# EAGLE design nfc-pn532 (EAGLE 9.6.2)
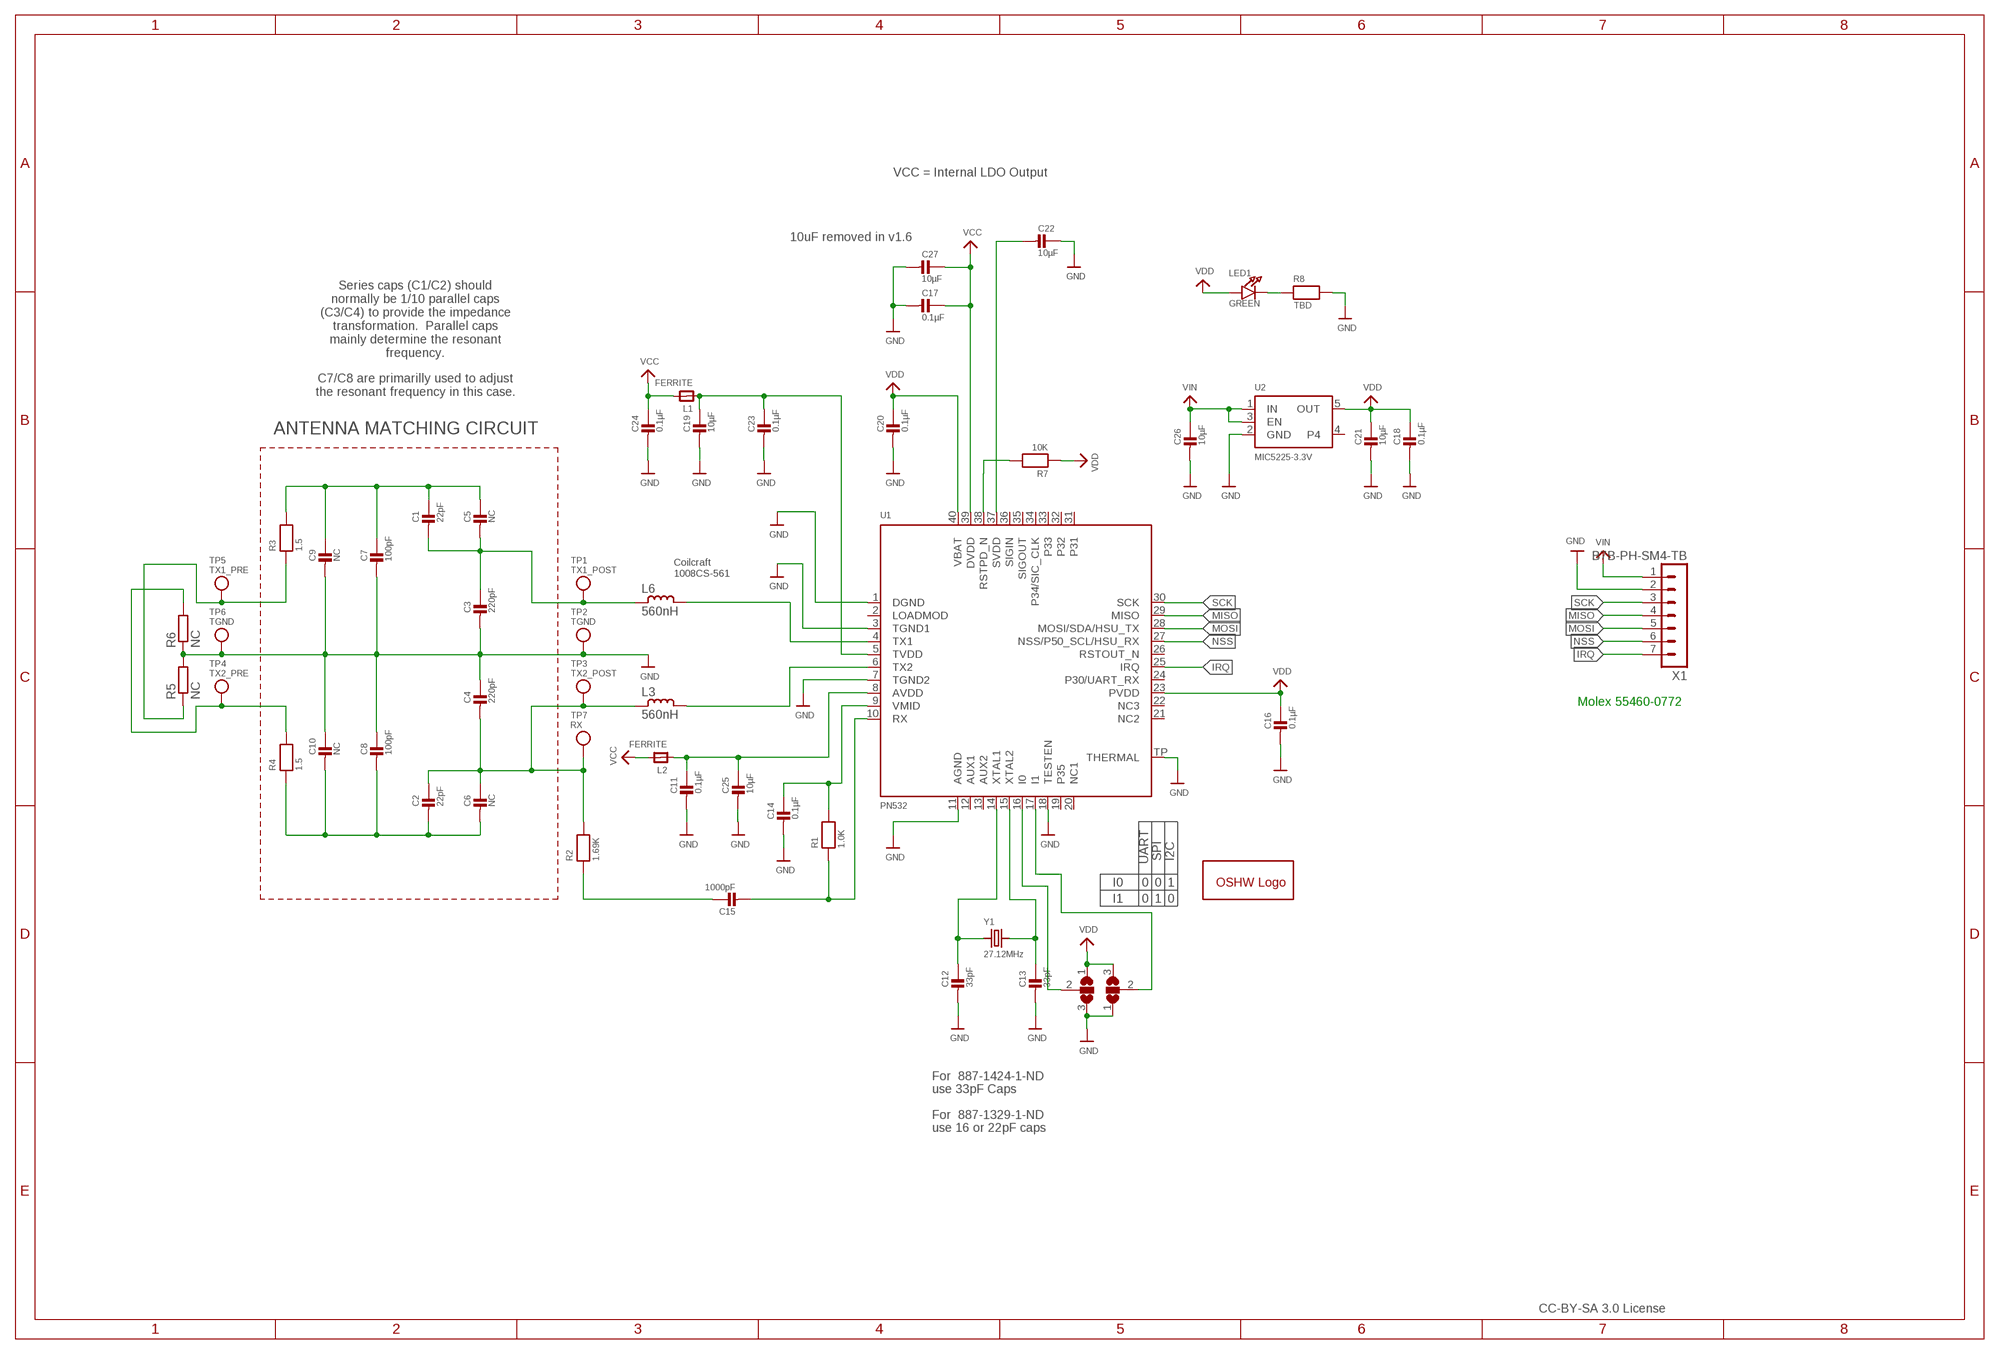
[diagram p0: schematic, sheet 1]

## Parts
C1  22pF  CAP_CERAMIC0805-NOOUTLINE  [0805-NO]
C2  22pF  CAP_CERAMIC0805-NOOUTLINE  [0805-NO]
C3  220pF  CAP_CERAMIC0805-NOOUTLINE  [0805-NO]
C4  220pF  CAP_CERAMIC0805-NOOUTLINE  [0805-NO]
C5  NC  CAP_CERAMIC0805-NOOUTLINE  [0805-NO]
C6  NC  CAP_CERAMIC0805-NOOUTLINE  [0805-NO]
C7  100pF  CAP_CERAMIC0805-NOOUTLINE  [0805-NO]
C8  100pF  CAP_CERAMIC0805-NOOUTLINE  [0805-NO]
C9  NC  CAP_CERAMIC0805-NOOUTLINE  [0805-NO]
C10  NC  CAP_CERAMIC0805-NOOUTLINE  [0805-NO]
C11  0.1µF  CAP_CERAMIC0805-NOOUTLINE  [0805-NO]
C12  33pF  CAP_CERAMIC0805-NOOUTLINE  [0805-NO]
C13  33pF  CAP_CERAMIC0805-NOOUTLINE  [0805-NO]
C14  0.1µF  CAP_CERAMIC0805-NOOUTLINE  [0805-NO]
C15  1000pF  CAP_CERAMIC0805-NOOUTLINE  [0805-NO]
C16  0.1µF  CAP_CERAMIC0805-NOOUTLINE  [0805-NO]
C17  0.1µF  CAP_CERAMIC0805-NOOUTLINE  [0805-NO]
C18  0.1µF  CAP_CERAMIC0805-NOOUTLINE  [0805-NO]
C19  10µF  CAP_CERAMIC0805-NOOUTLINE  [0805-NO]
C20  0.1µF  CAP_CERAMIC0805-NOOUTLINE  [0805-NO]
C21  10µF  CAP_CERAMIC0805-NOOUTLINE  [0805-NO]
C22  10µF  CAP_CERAMIC0805-NOOUTLINE  [0805-NO]
C23  0.1µF  CAP_CERAMIC0805-NOOUTLINE  [0805-NO]
C24  0.1µF  CAP_CERAMIC0805-NOOUTLINE  [0805-NO]
C25  10µF  CAP_CERAMIC0805-NOOUTLINE  [0805-NO]
C26  10µF  CAP_CERAMIC0805-NOOUTLINE  [0805-NO]
C27  10µF  CAP_CERAMIC0805-NOOUTLINE  [0805-NO]
GOLD_ORB_SM1  OSHWLOGOLOGO5MM  [OSHW_5MM]
L1  FERRITE  FERRITE0805  [0805]
L2  FERRITE  FERRITE0805  [0805]
L3  560nH  L-1008CS  [L1008CS]
L6  560nH  L-1008CS  [L1008CS]
LED1  GREEN  LED0805_NOOUTLINE  [CHIPLED_0805_NOOUTLINE]
R1  1.0K  RESISTOR0805_NOOUTLINE  [0805-NO]
R2  1.69K  RESISTOR0805_NOOUTLINE  [0805-NO]
R3  1.5  RESISTOR0805_NOOUTLINE  [0805-NO]
R4  1.5  RESISTOR0805_NOOUTLINE  [0805-NO]
R5  NC  R-EU_R0201  [R0201]
R6  NC  R-EU_R0201  [R0201]
R7  10K  RESISTOR0805_NOOUTLINE  [0805-NO]
R8  TBD  RESISTOR0805_NOOUTLINE  [0805-NO]
SJ1  SJ2W  [SJ_2]
SJ2  SJ2W  [SJ_2]
TP1  TX1_POST  TESTPOINTROUND1MM  [TESTPOINT_ROUND_1MM]
TP2  TGND  TESTPOINTROUND1MM  [TESTPOINT_ROUND_1MM]
TP3  TX2_POST  TESTPOINTROUND1MM  [TESTPOINT_ROUND_1MM]
TP4  TX2_PRE  TESTPOINTROUND1MM  [TESTPOINT_ROUND_1MM]
TP5  TX1_PRE  TESTPOINTROUND1MM  [TESTPOINT_ROUND_1MM]
TP6  TGND  TESTPOINTROUND1MM  [TESTPOINT_ROUND_1MM]
TP7  RX  TESTPOINTROUND1MM  [TESTPOINT_ROUND_1MM]
U1  PN532  [HVQFN40-6X6]
U2  MIC5225-3.3V  VREG_SOT23-5  [SOT23-5]
X1  B7B-PH-SM4-TB  [B7B-PH-SM4-TB]
Y1  27.12MHz  CRYSTAL3.2X2.5  [CRYSTAL_3.2X2.5]

## Nets
+5.0V: C26.1 U2.1(IN) U2.3(EN) X1.1 ; supply symbol labelled VIN
GND: C3.2 C4.1 C7.2 C8.1 C9.2 C10.1 C11.2 C12.2 C13.2 C14.2 C16.2 C17.2 C18.2 C19.2 C20.2 C21.2 C22.1 C23.2 C24.2 C25.2 C26.2 C27.2 R5.2 R6.1 R8.2 SJ1.3 SJ2.1 TP2.P$1 TP6.P$1 U1.1(DGND) U1.3(TGND1) U1.7(TGND2) U1.11(AGND) U1.18(TESTEN) U1.TP(THERMAL) U2.2(GND) X1.2
IRQ: U1.25(IRQ) X1.7
MISO: U1.29(MISO) X1.4
MOSI: U1.28(MOSI/SDA/HSU_TX) X1.5
N$1: L6.2 U1.4(TX1)
N$2: L3.2 U1.6(TX2)
N$3: C1.2 C3.1 C5.2 L6.1 TP1.P$1
N$4: SJ1.2 U1.16(I0)
N$5: SJ2.2 U1.17(I1)
N$6: LED1.C R8.1
N$7: C12.1 U1.14(XTAL1) Y1.1
N$8: C13.1 U1.15(XTAL2) Y1.2
N$9: C15.1 R2.1
N$10: C14.1 R1.2 U1.9(VMID)
N$11: C15.2 R1.1 U1.10(RX)
N$12: C2.1 C4.2 C6.1 L3.1 R2.2 TP3.P$1 TP7.P$1
N$13: C11.1 C25.1 L2.1 U1.8(AVDD)
N$14: C19.1 C23.1 L1.1 U1.5(TVDD)
N$15: C22.2 U1.37(SVDD)
N$16: R3.1 R5.1 TP5.P$1
N$17: R4.2 R6.2 TP4.P$1
NSS: U1.27(NSS/P50_SCL/HSU_RX) X1.6
RSTPD_N: R7.2 U1.38(RSTPD_N)
SCK: U1.30(SCK) X1.3
TX1_ANTENNA: C1.1 C5.1 C7.1 C9.1 R3.2
TX2_ANTENNA: C2.2 C6.2 C8.2 C10.2 R4.1
VCC: C17.1 C24.1 C27.1 L1.2 L2.2 U1.39(DVDD)
VDD: C16.1 C18.1 C20.1 C21.1 LED1.A R7.1 SJ1.1 SJ2.3 U1.23(PVDD) U1.40(VBAT) U2.5(OUT)
Unconnected: U1.2(LOADMOD) U1.12(AUX1) U1.13(AUX2) U1.19(P35) U1.20(NC1) U1.21(NC2) U1.22(NC3) U1.24(P30/UART_RX) U1.26(RSTOUT_N) U1.31 U1.32 U1.33 U1.34(P34/SIC_CLK) U1.35(SIGOUT) U1.36(SIGIN) U2.4

## Notes on the sheet
- VCC = Internal LDO Output
- 10uF removed in v1.6
- Series caps (C1/C2) should
  normally be 1/10 parallel caps
  (C3/C4) to provide the impedance
  transformation.  Parallel caps
  mainly determine the resonant
  frequency.
- C7/C8 are primarilly used to adjust
  the resonant frequency in this case.
- ANTENNA MATCHING CIRCUIT
- Coilcraft 
  1008CS-561
- Molex 55460-0772
- UART | SPI | I2C
- I0 | 0 | 0 | 1
- I1 | 0 | 1 | 0
- For  887-1424-1-ND
- use 33pF Caps
- For  887-1329-1-ND
- use 16 or 22pF caps
- CC-BY-SA 3.0 License

## Library data of the parts
C1-C27 = microbuilder:CAP_CERAMIC: Ceramic Capacitors For new designs, use the packages preceded by an '_' character since they are more reliable: The following footprints should be used on most boards: _0402 - Standard footprint for regular board layouts _0603 - Standard footprint for regular board layouts _0805 - Standard footprint for regular board layouts For extremely tight-pitch boards where space is at a premium, the following 'micro-pitch' footprints can be used (smaller pads, no silkscreen outline, etc.): _0402MP - Micro-pitch footprint for very dense/compact boards _0603MP - Micro-pitch footprint for very dense/compact boards _0805MP - Micro-pitch footprint for very dense/compact boards Commonly Stocked Parts 0402 - 0402 Surface Mount Capacitors 16pF 50V 5% [Digikey: 445-4899-2-ND] 18pF 50V 5% [Digikey: 490-1281-2-ND] 22pF 50V 5% [Digikey: 490-1283-2-ND] 68pF 50V 5% [Digikey: 490-1289-2-ND] 0.1uF 10V 10% [Digikey: 490-1318-2-ND] 1.0uF 6.3V 10% [Digikey: 490-1320-2-ND] 0603 - 0603 Surface Mount Capacitors 16 pF 50V 5% [Digikey: 445-5051-2-ND] 22 pF 50V [Digikey: PCC220ACVTR-ND] 33 pF 50V 5% [Digikey: 490-1415-1-ND] 56pF 50V 5% [Digikey: 490-1421-1-ND] 220pF 50V 5% [Digikey: 445-1285-1-ND] 680 pF 50V 2200 pF 50V 5% C0G [Digikey: 445-1297-1-ND] 5600 pF 100V 5% X7R [Digikey: 478-3711-1-ND] 0.1 µF 25V 10% [Digikey: PCC2277TR-ND] 0.22 µF 16V 10% X7R [Digikey: 445-1318-1-ND] 1.0 µF 25V 10% [Digikey: 445-5146-2-ND] 0603 - RF Specific 3pF 250V +/-0.1pF RF [Digikey: 712-1347-1-ND] 18 pF 250V 5% [Digikey: 478-3505-1-ND or 712-1322-1-ND] 56 pF 250V 5% C0G RF [Digikey: 490-4867-1-ND] 68 pF 250V RF [Digikey: 490-4868-1-ND] 0805 - 0805 Surface Mount Capacitors 220 pF 250V 2% RF Ceramic Capacitor [Digikey: 712-1398-1-ND] 1000 pF 50V 2% NP0 Ceramic Capacitor [Digikey: 478-3760-1-ND] 0.1 µF 25V 10% Ceramic Capacitor [Digikey: PCC1828TR-ND] 1.0 µF 16V 10% Ceramic Capacitor[Digikey: 490-1691-2-ND] 10.0 µF 10V 10% Ceramic Capacitor[Digikey: 709-1228-1-ND] 10.0 uF 16V 10% Ceramic Capacitor [Digikey: 478-5165-2-ND] 47 uF 6.3V 20% Ceramic Capacitor [Digikey: 587-1779-1-ND or 399-5506-1-ND] 1206 - 1206 Surface Mount Capacitors 47uF 10V 20% Ceramic Capacitor [Digikey: 490-5528-1-ND or 399-5508-1-ND or 445-6010-1-ND] 100uF 6.3V -20%, +80% Y5V Ceramic Capacitor (Digikey: 490-4512-1-ND, Mouser: 81-GRM31CF50J107ZE1L)
GOLD_ORB_SM1 = oshw:OSHWLOGO: The OSHW logo for PCB layout
L1 L2 = microbuilder:FERRITE: Ferrite Bead 0603 MMZ1608B121C - 120 Ohm @ 100MHz, 600mA, 0.15 Ohm DC Resistance - Digikey: 445-2164-1-ND BK1608HW121-T - 120 Ohm, 600mA Ferrite Chip - Digikey: 587-1876-2-ND 0805 HZ0805B272R-10 - 2.7K Ohm @ 100MHz, 200mA, 0.8 Ohm DC Resistance - Digikey: 240-2504-1-ND (see also Murata BLM21BD272SN1L) MMZ2012Y152B - 1.5K Ohm @ 100MHz, 500mA, 0.4 Ohm DC Resistance - Digikey: 445-1560-1-ND - Mainly for high frequency (80-400MHz) MMZ2012R102A - 1K Ohm @ 100MHz, 500mA, 0.3 Ohm DC Resistance - Digikey: 445-1555-2-ND - More general purpose (10-200MHz)
L3 L6 = inductor-coilcraft:L-: SMD INDUCTOR
LED1 = microbuilder:LED: LED 0603 - 0603 Surface Mount Package 2mA: Green LED - Low Power (3.9mcd, 2ma, 1.7Vf) - Digikey: 475-2709-2-ND Orange LED - Low Power (9.8mcd, 2ma, 1.8Vf) - Digikey: 475-1194-2-ND Red LED - Low Power (5mcd, 2ma, 1.8Vf) - Digikey: 475-1195-2-ND Yellow LED - Low Power (7mcd, 2ma, 1.8Vf) - Digikey: 475-1196-2-ND 5mA: Blue LED - Low Power (17mcd, 5ma, 2.9Vf) - Digikey: LNJ937W8CRACT-ND 0805 - 0805 Surface Mount Package 2mA: Red LED (8.8mcd, 2mA, 1.8Vf, Clear) - Low Power [Digikey: 475-2510-1-ND] Green LED (5mcd, 2mA, 1.8Vf, Clear) - Low Power [Digikey: 475-2730-1-ND] Yellow LED (11.3mcd, 2mA, 1.8Vf, Clear) - Low Power [Digikey: 475-2555-1-ND] 20mA: Red LED (104mcd, 20mA, Diffused) - LS R976 [Digikey: 475-1278-6-ND] Red LED (12mcd, 20mA, 2.0Vf, Clear) - APT2012EC [Digikey: 754-1128-1-ND] Green LED (15mcd, 20mA, 2.2Vf, Clear) - APT2012GC [Digikey: 754-1131-1-ND] Orange LED (160mcd, 20mA, 2.1Vf, Clear) - APT2012SECK [Digikey: 754-1130-1-ND] 1206 - 1206 Surface Mount Package Green LED (26mcd, 20mA, Diffused) - LG N971 [Digikey: 475-1407-6-ND] Red LED (15mcd, 20mA, Diffused) - LH N974 [Digikey: 475-1416-6-ND] Cree - Cree High-Power Surface Mount LEDs XPEBWT-L1-0000-00D50 - White 111lm 350mA 2.9Vf 6200K 110° XTEAWT-00-0000-00000LEE3 - White 114lm 350mA 2.85Vf 5000K 115° Everlight - Everlight 45-21 Series Surface Mount LEDs 45-21/QK2C-B2832AC2CB2/2T - Warm White 2000mcd 20mA 3.25Vf 3050K 120° 45-21/LK2C-B38452C4CB2/2T - Nuetral White 2000mcd 20mA 3.25Vf 4150K 120° 45-21/LK2C-B50634C6CB2/2T - Cold White 2200mcd 20mA 3.25Vf 5650K 120° PLCC2 Reverse Mount LS T77K-J1L2-1-0-2-R18-Z - Red 11.25mcd 2mA 1.8Vf 630nm 120° LO T77K-L1M2-24-Z - Orange 19.6mcd 2mA 1.8Vf 606nm 120° LY T77K-K2M1-26-Z - Yellow 15.7mcd 2mA 1.8Vf 587nm 120°
R1-R4 R7 R8 = microbuilder:RESISTOR: Resistors For new designs, use the packages preceded by an '_' character since they are more reliable: The following footprints should be used on most boards: _0402 - Standard footprint for regular board layouts _0603 - Standard footprint for regular board layouts _0805 - Standard footprint for regular board layouts For extremely tight-pitch boards where space is at a premium, the following 'micro-pitch' footprints can be used (smaller pads, no silkscreen outline, etc.): _0402MP - Micro-pitch footprint for very dense/compact boards _0603MP - Micro-pitch footprint for very dense/compact boards _0805MP - Micro-pitch footprint for very dense/compact boards
R5 R6 = rcl:R-EU_: RESISTOR, European symbol
SJ1 SJ2 = jumper:SJ2W: SMD solder JUMPER
TP1-TP7 = microbuilder:TESTPOINT: Test Point Various test points for characterisation and PCB testing TESTPOINT_SMT - Compact Surface Mount Test Point [Digikey: 5016KTR-ND]
U1 = microbuilder:PN532: PN532 - Near Field Communication (NFC) controller Highly integrated transceiver module for contactless communication at 13.56 MHz (14443A/MIFARE, FeliCa, I4443B)
U2 = microbuilder:VREG_SOT23-5: SOT23-5 Fixed Voltage Regulators Part Current Out V Out V In V Dropout θJA (°C/W) TJ (°C) Digikey Part No. ADP121 150mA 3.3V 3.4-5.5V 0.09V @ 150mA -- -- ADP121-AUJZ33R7CT-ND ADP121 150mA 3.0V 3.1-5.5V 0.09V @ 150mA -- -- ADP121-AUJZ30R7CT-ND ADP122 300mA 3.3V 3.4-5.5V 0.085V @ 300mA -- -- ADP122AUJZ-3.3-R7CT-ND ADP1712 300mA 3.3V 3.5-5.5V 0.17V @ 300mA -- -- ADP1712AUJZ-3.3-R7TR-ND AP7311 (Low Cost) 150mA 3.3V 3.5-6V 0.15V @ 150mA -- -- AP7311-33WG-7DICT-ND LD39015M18R 150mA 1.8V 1.9V-5.5V 0.08V @ 100mA -- -- 497-6977-1-ND LP2985A-33DBVR 150mA 3.3V 3.3-16V 0.28V @ 150mA 206 150 296-18479-1-ND MCP1824T-3302E/OT 300mA 3.3V 3.5V-6V 0.2V @ 300mA -- -- MCP1824T-3302E/OTCT-ND MIC5205-2.5YM5 TR 150mA 2.5V 2.7-16V 0.165V @ 150mA -- -- 576-1257-2-ND MIC5205-3.0YM5 TR 150mA 3.0V 3.2V-16V 0.165V @ 150mA -- -- 576-1258-2-ND MIC5205-3.3YM5 TR 150mA 3.3V 3.5V-16V 0.165V @ 150mA -- -- 576-1259-2-ND TPS780330220 150mA 3.3V+2.2V 3.6-5.5V 250mV Max -- -- 296-23332-1-ND TDA3663/N1,135 100mA 3.3V 3.5-45V 0.18V @ 50mA -- -- 568-5343-1-ND Max operating temp can be calculated using θJA, TJ (max junction temperature), and power in watts. Set the "Maximum Ambient Temperature" until it reaches TJ ("Max Junction Temperature"), which is the absolute limit for safe use of the regulator: Heat Sink Temperature Calculator <http://www.daycounter.com/Calculators/Heat-Sink-Temperature-Calculator.phtml> For example, With 12V source into a 3.3V LP2985 and a 30mA load, we are dissipating (12V-3.3V) * 0.03A = 0.261W. With a θJA of 206 °C/W, a TJ of 150°C, and 261mW we can safely use the chip without a heat sink up to 75°C (=147.1°C Junction Temperature).
X1 = con-JST PH:B7B-PH: JST PH series header 2.00mm pitch disconnectable crimp style connectors, vertical (side entry type), 7 pins
Y1 = microbuilder:CRYSTAL: Crystals HC49UP - Surface Mount Crystal 4.0MHz 18pF +/-30ppm Surface Mount Crystal [Digikey: 535-9857-1-ND] 12.0 MHz Surface Mount Crystal [Digikey: 535-9869-6-ND] 25.0 MHz Surface Mount Crystal [Digikey: 535-9078-1-ND] 2.5 x 2.0mm - MEMs SMT Crystal 16.0 MHz 10pF 20ppm 2.5 x 2.0mm Crystal [Digikey -40-85°C: 535-10923-1-ND] 3.2 x 2.5mm - MEMs SMT Crystal 12.0 MHz 8pF 15ppm 3.2 x 2.5mm Crystal [Digikey: -10-70°C: 644-1047-1-ND -40-125°C: 644-1128-1-ND] 40~85°C cheaper: 644-1173-6-ND 16.0 MHz 8pF 15ppm 3.2 x 2.5mm Crystal [Digikey: -10-70°C: 644-1049-1-ND -40-125°C: 644-1129-2-ND]-40~85°C cheaper: 644-1175-6-ND 16.0 MHz 10pF 10ppm 3.2 x 2.5mm Crystal [Digikey: 644-1100-1-ND] 27.12 MHz 18pF 30ppm 3.2 x 2.5mm Crystal [Digikey: 887-1424-1-ND] 27.12MHz 10pF 10ppm 3.2 x 2.5mm Crystal [Digikey: 887-1329-1-ND] 4.9 x 1.8mm - MEMs SMT Crystal 32.768 KHz 12.5pF 20ppm 4.9 x 1.8mm Crystal [Digikey: SE2415CT-ND] 8.0 x 3.8mm - Surface Mount Crystal 32.768kHz 12.5pF 20ppm -40°C-85°C [Digikey: 535-9166-2-ND] Cylinder 32.768KHz Cylinder Crystal (2x6mm body) [Ex. Digikey: 300-8341-2-ND]

## Board
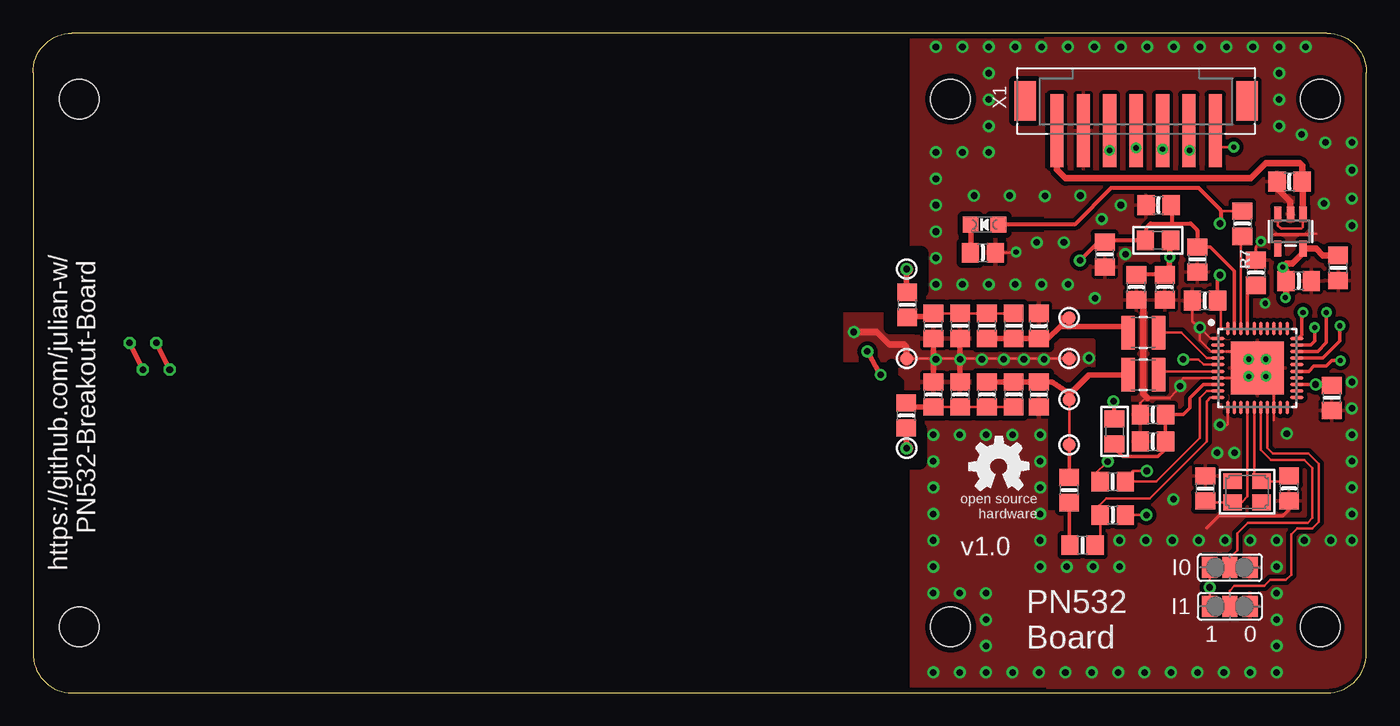
[diagram p1: board, top side]
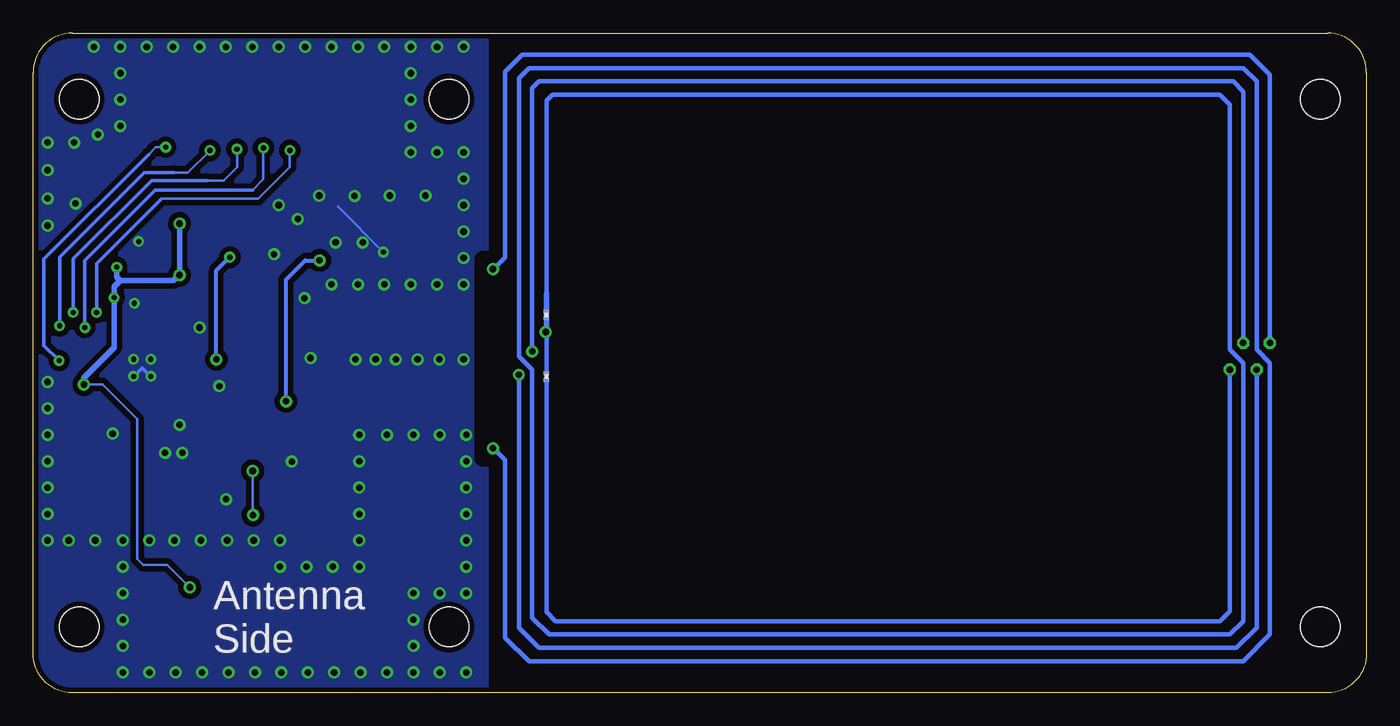
[diagram p2: board, bottom side, seen from below]

Size 101 x 50 mm. Coordinates in mm from the lower left corner, seen from the top.
Outline: 98,50 2.94,50 arc90 0,47 0,3 arc90 2.94,0 98,0 arc90 101,3 101,47 arc90 98,50
Copper layers (1*16): Top 0.035mm / dielectric 1.5mm / Bottom 0.035mm
Design rules "adafruit *": minimum track width 8mil, minimum drill 15.5mil, track to track 8mil, track to pad 8mil, pad to pad 8mil, via to via 8mil, smd to smd 0mil, copper to edge 10mil, drill to drill 8mil, minimum pad ring 10mil, minimum via ring 8mil, stop-mask expansion 2mil, vias tented up to drill 20mil, thermal gap 10mil
Holes 3 mm at 3.5,45 3.5,5 69.5,45 69.5,5 97.5,45 97.5,5
tRestrict: area 6,22.5 to 11.1,23.7; area 6,27.3 to 11.1,28.6; area 11.6,6.5 to 60.9,44.3; 12 lines
bRestrict: 3 lines

### Footprints (pad centres in the part's own frame; a part is rotated, then mirrored left to right if it is on the bottom)
0805-NO = smd 1.3 x 1.5: 1 -0.95,0; 2 0.95,0
0805 = smd 1.3 x 1.5: 1 -0.95,0; 2 0.95,0
L1008CS = smd 1.02 x 2.54: 1 -1.145,0; 2 1.145,0
CHIPLED_0805_NOOUTLINE = smd 1.2 x 1.2: A 0,-1.05; C 0,1.05
R0201 = smd 0.28 x 0.43: 1 -0.255,0; 2 0.255,0
SJ_2 = smd 1.168 x 1.6: 1 -1.524,0; 2 0,0; 3 1.524,0
TESTPOINT_ROUND_1MM = smd 1 x 1: P$1 0,0
HVQFN40-6X6 = smd 1 x 0.25: 1 -2.99,2.25; 2 -2.99,1.75; 3 -2.99,1.25; 4 -2.99,0.75; 5 -2.99,0.25; 6 -2.99,-0.25; 7 -2.99,-0.75; 8 -2.99,-1.25; 9 -2.99,-1.75; 10 -2.99,-2.25; 21 2.99,-2.25; 22 2.99,-1.75; 23 2.99,-1.25; 24 2.99,-0.75; 25 2.99,-0.25; 26 2.99,0.25; 27 2.99,0.75; 28 2.99,1.25; 29 2.99,1.75; 30 2.99,2.25 | smd 0.25 x 1: 11 -2.25,-2.99; 12 -1.75,-2.99; 13 -1.25,-2.99; 14 -0.75,-2.99; 15 -0.25,-2.99; 16 0.25,-2.99; 17 0.75,-2.99; 18 1.25,-2.99; 19 1.75,-2.99; 20 2.25,-2.99; 31 2.25,2.99; 32 1.75,2.99; 33 1.25,2.99; 34 0.75,2.99; 35 0.25,2.99; 36 -0.25,2.99; 37 -0.75,2.99; 38 -1.25,2.99; 39 -1.75,2.99; 40 -2.25,2.99 | smd 4 x 4: TP 0,0
SOT23-5 = smd 0.55 x 1.2: 1 -0.95,-1.3; 2 0,-1.3; 3 0.95,-1.3; 4 0.95,1.3; 5 -0.95,1.3
B7B-PH-SM4-TB = smd 1 x 5.5: 1 6,0; 2 4,0; 3 2,0; 4 0,0; 5 -2,0; 6 -4,0; 7 -6,0 | smd 1.6 x 3: M1 8.4,-2.25; M2 -8.4,-2.25
CRYSTAL_3.2X2.5 = smd 1.4 x 1.2: 1 -1.1,-0.8; 2 1.1,0.8; GND1 -1.1,0.8; GND2 1.1,-0.8

### Placement (x,y rotation side)
C1  72.25,27.81 270 top
C2  72.25,22.61 270 top
C3  76.18,27.81 90 top
C4  76.18,22.61 90 top
C5  74.28,27.81 270 top
C6  74.28,22.61 270 top
C7  70.22,27.81 270 top
C8  70.22,22.61 270 top
C9  68.19,27.81 270 top
C10  68.19,22.61 270 top
C11  84.83,19.05 180 top
C12  88.78,15.49 90 top
C13  95.13,15.49 270 top
C14  81.78,16.01 180 top
C15  79.49,11.19 0 top
C16  98.37,22.35 270 top
C17  88.19,32.84 270 top
C18  98.85,32.2 270 top
C19  83.56,30.73 270 top
C20  88.77,29.72 180 top
C21  95.86,31.21 0 top
C22  92.62,31.84 270 top
C23  85.72,30.73 270 top
C24  81.18,33.22 270 top
C25  84.83,21.08 180 top
C26  95.17,38.73 180 top
C27  85.25,36.95 180 top
GOLD_ORB_SM1  73.15,17.15 0 top
L1  85.21,34.29 180 top
L2  81.91,19.81 90 top
L3  84.1,24.1 0 top
L6  84.1,27.3 0 top
LED1  72.07,35.48 90 top
R1  81.78,13.47 0 top
R2  78.48,15.37 90 top
R3  66.21,29.41 270 top
R4  66.14,21.02 270 top
R5  62.12,23.96 270 bottom
R6  62.12,28.64 90 bottom
R7  91.6,35.55 270 top
R8  71.94,33.35 0 top
SJ1  90.65,9.5 0 top
SJ2  90.65,6.55 180 top
TP1  78.48,28.43 0 top
TP2  78.48,25.33 0 top
TP3  78.48,22.22 0 top
TP4  66.17,18.54 0 top
TP5  66.17,32.11 0 top
TP6  66.17,25.33 0 top
TP7  78.48,18.8 0 top
U1  92.73,24.62 0 top
U2  95.24,34.96 180 top
X1  83.55,42.6 180 top
Y1  91.96,15.24 0 top

### Tracks (layer width: path | path; a pad name or v marks a point on that pad's centre or on a via)
+5.0V
  Top 0.203: U2.3 94.29,35.42 94.54,35.18 96.06,35.18 96.19,35.31 U2.1
  Top 0.508: U2.1 96.19,38.66 C26.1 96.12,39.95 95.93,40.13 93.38,40.13 92.25,39 85.5,39 78.2,39 77.55,39.65 X1.1
GND  (via drill 0.39, 0.5)
  Top 0.203: 93.98,20.67 U1.18 93.98,23.37 U1.TP | U1.1 89.2,26.87 v88.38,27.69 | C13.2 95.47,14.48 | TP6.P$1 70.22,25.33 TP2.P$1 | U1.11 90.48,20.4 90.41,20.32 v89.91,20.32 | 91.69,23.88 91.68,23.87 U1.7 87.12,23.87 87.11,23.88 86.61,23.37 86.61,22.86 86.1,22.35 84.4,22.35 84.25,22.35 83.88,21.98 C25.2 | 90.92,26.42 91.18,26.42 91.18,25.91 arc-90 91.14,25.87 U1.3 89.26,25.87 88.38,26.75 v88.38,27.69 | v81.4,17.53 80.38,16.55 C14.2 | C20.2 87.81,28.13 v88.38,27.69 | 94.04,34.75 94.07,34.72 | 96.53,34.72 96.6,34.8 97.2,34.8 | v74.47,33.4 74.42,33.35 R8.2 | C22.1 92.62,33.79 92.66,33.82 92.66,33.85 v93,34.2
  Top 0.254: 94.07,34.72 96.53,34.72 | C13.2 95.13,13.88 94.65,13.4 89.8,13.4 88.9,12.5 | U1.TP 92.09,23.98 v92.08,23.98
  Top 0.406: C8.1 70.22,25.33 C7.2 | C10.1 C9.2
  Top 0.5: 62.22,27.3 v62.17,27.35 63.9,27.35 64.85,26.4 65.95,26.4 66.17,26.18 TP6.P$1
  Top 0.508: U2.2 95.24,37.21 94.22,38.23 C26.2 | 84.1,22.65 84.4,22.35 | 84.1,23.4 84.1,22.65 | C19.2 84.1,29.25 84.1,22.65
  Bottom 0.203: 77.9,36.83 v74.47,33.4
  Bottom 0.254: R6.1 62.12,27.4 | v92.08,23.98 U1.TP v93.38,23.98
  Bottom 0.356: R5.2 62.12,27.3 v62.17,27.35 62.12,27.4 62.12,27.43
  Bottom 0.406: 62.12,30.23 62.12,29.43 62.12,28.43 62.12,27.43
  other vias: 68.39,25.27 70.22,25.27 71.87,25.27 73.53,25.27 86.89,23.24 82.75,33.24 80.95,35.91 89.69,18.19 94.97,19.66 86.38,14.68 76.57,25.27 75.05,25.27 68.19,7.56 68.19,9.56 68.19,11.56 68.19,13.56 68.19,15.56 68.19,17.56 68.19,19.56 70.19,19.56 72.19,19.56 74.19,19.56 76.29,19.56 68.39,30.96 68.39,32.96 68.39,34.96 68.39,36.96 68.39,38.96 68.39,40.96 68.39,48.96 70.39,30.96 72.39,30.96 74.39,30.96 76.39,30.96 78.39,30.96 80.44,29.91 76.29,17.56 76.29,15.56 76.29,13.56 76.29,11.56 76.29,9.56 78.29,9.56 80.29,9.56 82.29,9.56 82.29,11.56 84.29,11.56 86.29,11.56 88.29,11.56 90.29,11.56 94.19,11.56 96.29,11.56 98.29,11.56 99.89,11.56 99.89,13.56 99.89,15.56 99.89,17.56 99.89,19.56 99.89,21.56 99.89,23.56 99.89,35.41 99.89,37.46 68.19,1.56 70.19,1.56 72.19,1.56 74.19,1.56 76.19,1.56 78.19,1.56 80.19,1.56 82.19,1.56 84.19,1.56 86.19,1.56 88.19,1.56 90.19,1.56 92.19,1.56 94.19,3.56 94.19,5.56 94.19,7.56 94.19,9.56 92.19,11.56 70.39,48.96 72.39,48.96 74.39,48.96 76.39,48.96 78.39,48.96 80.39,48.96 82.39,48.96 84.39,48.96 86.39,48.96 88.39,48.96 90.39,48.96 92.39,48.96 94.39,48.96 99.89,39.61 99.89,41.71 79.33,37.68 78.08,34.13 93.33,29.53 97.78,37.08 71.28,37.68 73.98,37.68 79.98,25.38 92.08,25.28 93.38,25.28 91,18.19 76.65,37.66 76.03,34.13 82.4,36.96 70.19,7.56 72.19,3.56 72.19,5.56 72.19,7.56 70.39,40.96 72.39,40.96 72.39,42.96 72.39,44.96 72.39,46.96 94.19,1.56 96.39,48.96 94.39,46.96 94.39,44.96 94.39,42.96 96.09,42.31 97.89,41.71
  pour Top (isolate 0.305): 76.7,51.36 102.15,51.36 102.15,-1.01 76.85,-1.01 76.85,13.72 83.3,13.72 83.3,29.21 76.7,29.21
  pour Top (isolate 0.406): 66.57,50.11 76.07,50.76 76.7,50.76 76.7,-1.06 66.57,-1.06
  pour Top (isolate 0.406): 76.95,26.67 80.26,26.67 80.26,23.62 76.95,23.62
  pour Bottom (isolate 0.406): 66.7,-1.02 102.08,-1.02 102.08,51.37 66.7,51.37
  pour Top (isolate 0.305): 66.15,50.5 66.15,-1.8 66.6,-1.8 66.6,50.5
  pour Top (isolate 0.305): 66.9,23.05 64.65,25.3 60.5,25.3 60.5,28.6 66.95,28.6 66.95,23.05
IRQ  (via drill 0.39)
  Top 0.203: v90.95,41.35 90.05,41.35 89.55,41.85 X1.7
  Top 0.254: U1.25 96.62,24.37 97.02,24.77 97.97,24.77 98.38,25.18 v99.02,25.18
  Bottom 0.203: 92.25,40.8 91.7,41.35 v90.95,41.35
  Bottom 0.254: v99.02,25.18 100.17,26.33 100.17,32.88 92.25,40.8
MISO  (via drill 0.39)
  Top 0.203: v83.55,41.3 X1.4
  Top 0.254: U1.29 96.78,26.37 97.08,26.67 v97.08,27.69
  Bottom 0.203: 84.37,38.09 83.55,38.91 v83.55,41.3
  Bottom 0.254: v97.08,27.69 97.08,32.77 91.75,38.09 84.37,38.09
MOSI  (via drill 0.39)
  Top 0.203: X1.5 v85.55,41.2
  Top 0.254: U1.28 97.29,25.87 97.97,26.54 v97.97,28.83
  Bottom 0.203: v85.55,41.2 85.55,39.85 86.57,38.83 87.78,38.83
  Bottom 0.254: v97.97,28.83 97.97,32.89 92.03,38.83 87.78,38.83
N$1
  Top 0.203: U1.4 88.92,25.37 86.99,27.3 L6.2
N$2
  Top 0.203: L3.2 85.52,24.37 U1.6
N$3
  Top 0.203: C1.2 C5.2
  Top 0.406: TP1.P$1 77.93,28.39 77.93,27.9 77.8,27.77 | C1.2 C3.1 75.77,26.8 76.83,26.8 77.8,27.77 | L6.1 83,27.34 83,27.8 82.97,27.77 77.8,27.77
N$4
  Top 0.203: SJ1.2 90.65,10.25 91.2,10.8 91.2,12.1 92,12.9 96.55,12.9 96.9,13.25 96.9,17.05 96.3,17.65 93.75,17.65 92.98,18.42 U1.16
N$5
  Top 0.203: U1.17 93.48,18.57 93.9,18.15 96.6,18.15 97.4,17.35 97.4,12.95 96.9,12.45 95.75,12.45 95.3,12 95.3,8.95 94.9,8.55 93.7,8.55 93.25,8.1 91,8.1 90.65,7.75 SJ2.2
N$6
  Top 0.406: LED1.C 71.02,33.38 R8.1
N$7
  Top 0.203: C12.1 88.58,14.44 Y1.1 90.89,14.48 91.58,14.48 91.98,14.89 U1.14
N$8
  Top 0.203: C13.1 95.33,16.04 Y1.2 92.48,16.61 U1.15
N$9
  Top 0.254: R2.1 78.48,12.26 C15.1
N$10  (via drill 0.5)
  Top 0.203: U1.9 88.9,22.87 88.38,22.35 88.38,19.3 85.09,16.01 C14.1 83.29,16.82 v84.36,16.82 | R1.2 v84.34,13.47
  Bottom 0.203: v84.36,16.82 84.36,13.5 v84.34,13.47
N$11
  Top 0.203: U1.10 89.16,22.37 88.89,22.1 88.89,19.05 84.58,14.74 81.28,14.74 80.76,14.22 R1.1 80.83,11.57 C15.2
N$12
  Top 0.203: TP7.P$1 TP3.P$1
  Top 0.254: R2.2 TP7.P$1
  Top 0.406: C2.1 C6.1 C4.2 77.17,23.56 78.48,22.69 TP3.P$1 78.48,22.61 79.97,24.1 L3.1
N$13
  Top 0.203: L2.1 81.91,18.54
  Top 0.254: U1.8 88.64,23.37 87.62,22.35 87.62,21.59 87.11,21.08 C25.1 C11.1 85.68,18.38 85.21,17.91 82.54,17.91 81.91,18.54
N$14  (via drill 0.41, 0.5)
  Top 0.203: U1.5 88.66,24.87 88.26,25.27 v87.11,25.27
  Top 0.305: 85.72,31.71 C23.1 | 85.69,31.68 C19.1 | v86.1,33.02 86.08,33.01
  Top 0.406: 85.69,31.68 85.72,31.71 86.06,32.08 86.06,32.77 86.08,33.01 L1.1
  Bottom 0.305: v87.11,25.27 87.11,32 v86.1,33.02
N$15
  Top 0.254: C22.2 91.98,30.89 U1.37
N$16  (via drill 0.5, 0.5 pad 0.76)
  Top 0.406: v8.32,24.49 v7.31,26.52 | v64.2,24.11 v63.19,25.89 | v9.34,26.52 v10.36,24.49 | TP5.P$1 66.17,30.4 R3.1
  Bottom 0.356: v7.31,26.52 7.31,46.84 8.83,48.36 63.95,48.36 65.23,47.09 65.23,33 66.11,32.11 TP5.P$1 | v8.32,24.49 8.32,4.93 9.85,3.41 62.68,3.41 64.2,4.93 v64.2,24.11 | v63.19,25.89 63.19,45.82 62.68,46.33 10.1,46.33 9.34,45.57 v9.34,26.52 | v10.36,24.49 10.36,6.2 11.12,5.44 61.41,5.44 62.12,6.15 62.12,23.21 R5.1 62.12,24.34
  other vias: 66.17,32.11
N$17  (via drill 0.5 pad 0.76)
  Top 0.406: R4.2 66.14,18.57 TP4.P$1
  Bottom 0.356: R6.2 62.12,44.86 61.66,45.32 11.12,45.32 10.36,44.55 10.36,26.01 9.34,25 9.34,5.44 10.36,4.42 61.92,4.42 63.19,5.69 63.19,24.49 64.2,25.5 64.2,46.59 63.44,47.35 9.34,47.35 8.32,46.33 8.32,26.01 7.31,25 7.31,4.42 9.34,2.39 63.44,2.39 65.23,4.18 65.23,17.65 66.18,18.6 66.2,18.6 66.2,18.57 TP4.P$1
  other vias: 66.17,18.54
NSS  (via drill 0.39)
  Top 0.203: v87.6,41.1 87.55,41.15 X1.6
  Top 0.254: U1.27 97.68,25.37 98.98,26.67 v98.98,27.81
  Bottom 0.203: 90.33,39.42 89.28,39.42 v87.6,41.1
  Bottom 0.254: v98.98,27.81 98.98,33.02 92.63,39.37 92.58,39.42 90.33,39.42
RSTPD_N
  Top 0.203: R7.2 91.48,34.48 U1.38
SCK  (via drill 0.39)
  Top 0.203: X1.3 v81.55,41.1
  Top 0.254: v96.19,28.83 96.11,28.83 96.11,27.12 95.85,26.87 U1.30
  Bottom 0.203: v81.55,41.1 81.55,39.85 83.95,37.45 91.25,37.45 91.3,37.4
  Bottom 0.254: v96.19,28.83 96.19,32.51 91.3,37.4
TX1_ANTENNA
  Top 0.203: C9.1 C7.1 C1.1 C5.1
  Top 0.406: C9.1 68.16,28.5 66.26,28.5 R3.2
TX2_ANTENNA
  Top 0.203: C10.2 C8.2 C2.2 C6.2
  Top 0.406: C10.2 66.33,21.66 66.26,21.74 66.14,21.85 R4.1
VCC  (via drill 0.5)
  Top 0.254: U1.39 90.98,31.97 89.17,33.78 88.7,33.78 C17.1
  Top 0.305: L2.2 81.91,22.03 v81.84,22.1 | v79.3,32.77 80.7,34.17 C24.1 81.3,34.29 L1.2 84.36,35.29 84.63,35.56 86.25,35.56 | 86.25,35.56 87.68,35.56 88.19,35.05 C17.1 | C27.1 86.25,36.9 86.25,35.56
  Bottom 0.305: v81.84,22.1 81.84,31.24 81.84,31.31 80.38,32.77 v79.3,32.77
VDD  (via drill 0.39, 0.39 pad 0.76, 0.5, 0.5 pad 0.76)
  Top 0.203: v97.15,23.37 v97.14,23.37 | U1.40 90.04,27.61 89.96,27.69 89.96,29.2 C20.1 | SJ2.3 v89.13,8 SJ1.1 | R7.1 90.01,36.5 89.96,36.55
  Top 0.254: v97.14,23.37 U1.23 | C20.1 89.72,31.47 v89.91,31.66 | v97.15,23.37 97.21,23.3 C16.1
  Top 0.305: LED1.A 73.15,35.5 78.9,35.5 81.65,38.25 88.29,38.25 89.96,36.58 89.96,36.55 89.96,35.62 v89.91,35.56
  Top 0.5: v94.86,29.95 94.91,30 C21.1
  Top 0.508: C21.1 94.91,32.01 v94.66,32.26 94.92,32.51 95.38,32.51 96.19,33.33 U2.5 97.19,33.66 97.7,33.15 C18.1
  Bottom 0.203: v89.13,8 90.83,9.7 92.65,9.7 93.1,10.15 93.1,20.75 U1.23 v97.15,23.37
  Bottom 0.254: 89.96,31.66 v89.91,31.66
  Bottom 0.406: v97.15,23.37 97.15,23.88 94.86,26.16 v94.86,29.95 94.86,30.79 94.4,31.24 | 94.4,31.24 93.9,31.24 90.38,31.24 89.96,31.66 v89.91,31.66 v89.91,35.56 | 94.4,31.24 94.66,31.5 v94.66,32.26

### Text on the board
tNames: v1.0 | https://github.com/julian-w/ / PN532-Breakout-Board | I0 | I1 | 1 | 0 | PN532 / Board
bNames: Antenna / Side